# Altium schematic sheet powersupply_grid8_0.SchDoc: powersupply_grid8.sch
size 409 x 282 mm; Date: 12/19/2018 10:57:11 PM; SheetNumber: Sheet:
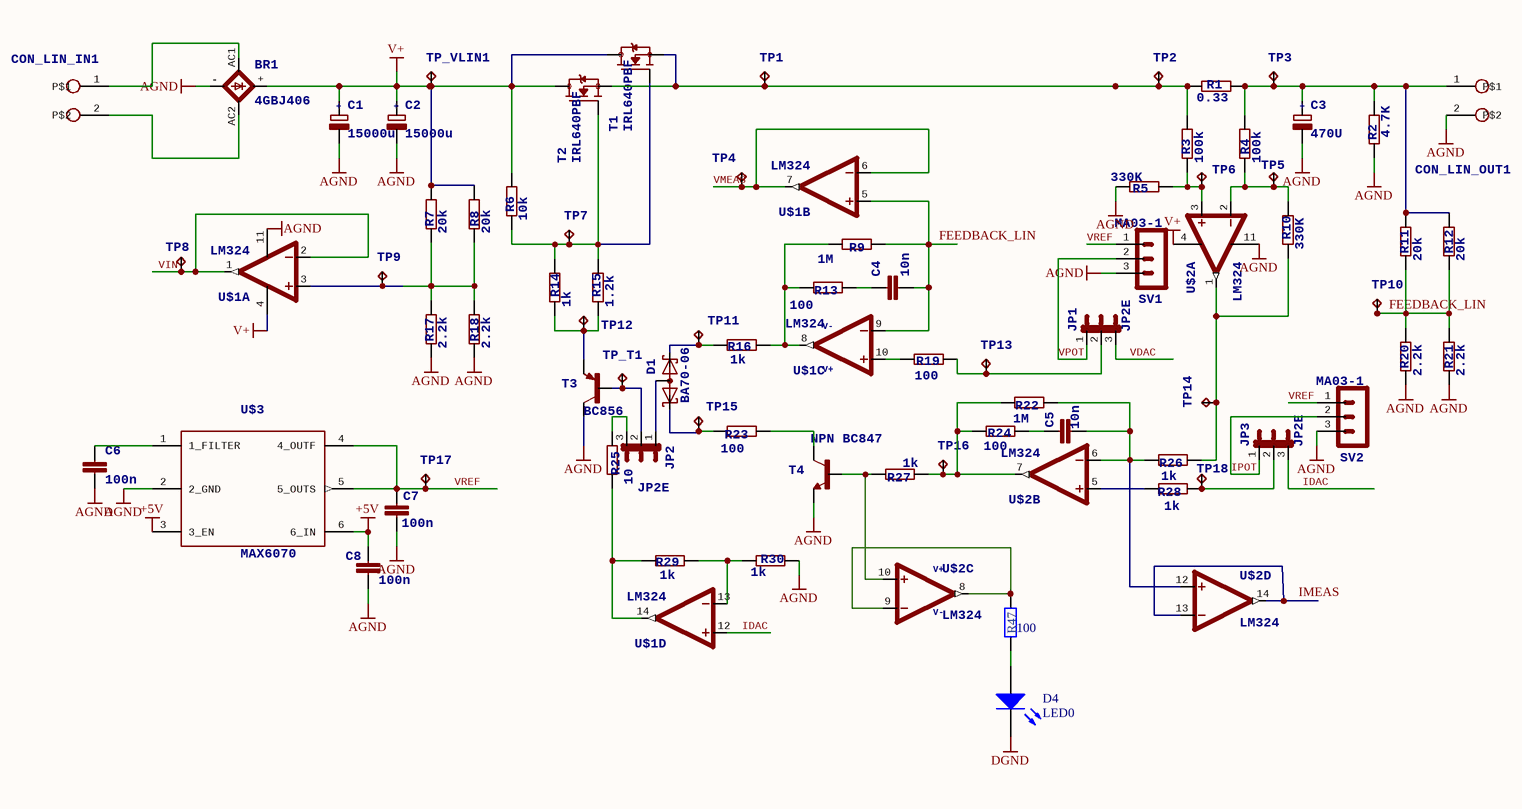
[diagram p0: powersupply_grid8_0.SchDoc]

## Parts
BR1  4GBJ406  [FB100]
C1  15000u  [EB30D]
C2  15000u  [EB30D]
C3  470U  [E5-13]
C4  10n  [C0805]
C5  10n  [C0805]
C6  100n  [C0402]
C7  100n  [C0402]
C8  100n  [C0402]
CON_LIN_IN1  POWERCON  [MKS1852-6-0-202]  (value not drawn)
CON_LIN_OUT1  POWERCON  [MKS1852-6-0-202]  (value not drawn)
D1  BA70-06  [SOT23]
D4  LED0  [LED-0]
JP1  JP2E  [JP2]
JP2  JP2E  [JP2]
JP3  JP2E  [JP2]
R1  0.33  [R2010]
R2  4.7K  [R2512]
R3  100k  [R0805]
R4  100k  [R0805]
R5  330K  [R0805]
R6  10k  [R0805]
R7  20k  [R0805]
R8  20k  [R0805]
R9  1M  [R0805]
R10  330K  [R0805]
R11  20k  [R0805]
R12  20k  [R0805]
R13  100  [R0805]
R14  1k  [R0805]
R15  1.2k  [R0805]
R16  1k  [R0805]
R17  2.2k  [R0805]
R18  2.2k  [R0805]
R19  100  [R0805]
R20  2.2k  [R0805]
R21  2.2k  [R0805]
R22  1M  [R0805]
R23  100  [R0805]
R24  100  [R0805]
R25  10  [R0805]
R26  1k  [R0805]
R27  1k  [R0805]
R28  1k  [R0805]
R29  1k  [R0805]
R30  1k  [R0805]
R47  value 100  [6-0805_L]  (hidden comment: Res2)
SV1  MA03-1  [MA03-1]
SV2  MA03-1  [MA03-1]
T1  IRL640PBF  [TO-220AB]
T2  IRL640PBF  [TO-220AB]
T3  BC856  [SOT23-BEC]
T4  NPN BC847  [SOT23-BEC]
TP1  TPB2,54  [B2,54]  (value not drawn)
TP2  TPB2,54  [B2,54]  (value not drawn)
TP3  TPB2,54  [B2,54]  (value not drawn)
TP4  TPB2,54  [B2,54]  (value not drawn)
TP5  TPB2,54  [B2,54]  (value not drawn)
TP6  TPB2,54  [B2,54]  (value not drawn)
TP7  TPB2,54  [B2,54]  (value not drawn)
TP8  TPB2,54  [B2,54]  (value not drawn)
TP9  TPB2,54  [B2,54]  (value not drawn)
TP10  TPB2,54  [B2,54]  (value not drawn)
TP11  TPB2,54  [B2,54]  (value not drawn)
TP12  TPB2,54  [B2,54]  (value not drawn)
TP13  TPB2,54  [B2,54]  (value not drawn)
TP14  TPB2,54  [B2,54]  (value not drawn)
TP15  TPB2,54  [B2,54]  (value not drawn)
TP16  TPB2,54  [B2,54]  (value not drawn)
TP17  TPB2,54  [B2,54]  (value not drawn)
TP18  TPB2,54  [B2,54]  (value not drawn)
TP_T1  TPB2,54  [B2,54]  (value not drawn)
TP_VLIN1  TPB2,54  [B2,54]  (value not drawn)
U$1  LM324  [SO14]  (parts A,B,C,D of 4)
U$2  LM324  [SO14]  (parts A,B,C,D of 4)
U$3  MAX6070  [SOT23-6]

## Nets
+5V: C8.1 U$3.3(3_EN) U$3.6(6_IN)
AGND: BR1.- C1.- C2.- C3.- C6.2 C7.2 C8.2 CON_LIN_OUT1.2(P$2) R2.1 R5.2 R17.1 R18.1 R20.1 R21.1 R30.2 SV1.3 SV2.3 T3.C T4.E U$1.11(V-) U$2.11(V-) U$3.2(2_GND)
DGND: D4.2(K)
V+: BR1.+ C1.+ C2.+ R6.2 R7.2 R8.2 T1.P$2(D) T2.P$2(D) TP_VLIN1.TP U$1.4(V+) U$2.4(V+)
FEEDBACK_LIN: C4.2 R9.1 R11.1 R12.1 R20.2 R21.2 TP10.TP U$1.5(+IN) U$1.9(-IN)
IDAC: JP3.3 U$1.12(+IN)
IMEAS: U$2.13(-IN) U$2.14(OUT)
IPOT: JP3.1 SV2.2
VDAC: JP1.3
VIN: TP8.TP U$1.1(OUT) U$1.2(-IN)
VMEAS: TP4.TP U$1.6(-IN) U$1.7(OUT)
VPOT: JP1.1 SV1.2
VREF: C7.1 SV1.1 SV2.1 TP17.TP U$3.4(4_OUTF) U$3.5(5_OUTS)
NetBR1_AC1: BR1.AC1 CON_LIN_IN1.1(P$1)
NetBR1_AC2: BR1.AC2 CON_LIN_IN1.2(P$2)
NetC3_+: C3.+ CON_LIN_OUT1.1(P$1) R1.2 R2.2 R4.2 R11.2 R12.2 TP3.TP
NetC4_1: C4.1 R13.1
NetC5_1: C5.1 R24.1
NetC5_2: C5.2 R22.1 R26.2 U$2.6(-IN) U$2.12(+IN)
NetC6_1: C6.1 U$3.1(1_FILTER)
NetD1_1: D1.1(K1) R23.2 TP15.TP
NetD1_2: D1.2(K2) R16.2 TP11.TP
NetD1_3: D1.3(AA) JP2.1
NetD4_1: D4.1(A) R47.2
NetJP1_2: JP1.2 R19.1 TP13.TP
NetJP2_2: JP2.2 T3.B TP_T1.TP
NetJP2_3: JP2.3 R25.1
NetJP3_2: JP3.2 R28.1 TP18.TP
NetR1_1: R1.1 R3.2 T1.P$3(S) T2.P$3(S) TP1.TP TP2.TP
NetR3_1: R3.1 R5.1 TP6.TP U$2.3(+IN)
NetR4_1: R4.1 R10.2 TP5.TP U$2.2(-IN)
NetR6_1: R6.1 R14.2 R15.2 T1.P$1(G) T2.P$1(G) TP7.TP
NetR7_1: R7.1 R8.1 R17.2 R18.2 TP9.TP U$1.3(+IN)
NetR9_2: R9.2 R13.2 R16.1 U$1.8(OUT)
NetR10_1: R10.1 R26.1 TP14.TP U$2.1(OUT)
NetR14_1: R14.1 R15.1 T3.E TP12.TP
NetR19_2: R19.2 U$1.10(+IN)
NetR22_2: R22.2 R24.2 R27.1 TP16.TP U$2.7(OUT)
NetR23_1: R23.1 T4.C
NetR25_2: R25.2 R29.2 U$1.14(OUT)
NetR27_2: R27.2 T4.B U$2.10(+IN)
NetR28_2: R28.2 U$2.5(+IN)
NetR29_1: R29.1 R30.1 U$1.13(-IN)
NetR47_1: R47.1 U$2.8(OUT) U$2.9(-IN)

## Notes on the sheet
- 1
- 2
- 3
- 4
- 5
- 6
- 7
- 8
- A
- B
- C
- D
- E

## Library data of the parts
C1 C2 = CPOL-EUE10-30: <B>POLARIZED CAPACITOR</B>, European symbol; +: +
C3 = CPOL-EUE5-13: <B>POLARIZED CAPACITOR</B>, European symbol; +: +
C4 C5 = C-EUC0805: <B>CAPACITOR</B>, European symbol; SPICEPREFIX: C
C6-C8 = C-EUC0402: <B>CAPACITOR</B>, European symbol; SPICEPREFIX: C
D1 = BAS40-06
D4 = LED0: Typical INFRARED GaAs LED; Published: 8-Jun-2000; LatestRevisionDate: 08-Jul-2005; LatestRevisionNote: Mech Layer 1 removed.; PackageReference: LED-0; Publisher: Altium Limited; PackageDescription: LED; 2 Leads
JP1-JP3 = JP2E: <b>JUMPER</b>
R1 = R-EU_R2010: <B>RESISTOR</B>, European symbol
R2 = R-EU_R2512: <B>RESISTOR</B>, European symbol
R3-R30 = R-EU_R0805: <B>RESISTOR</B>, European symbol
R47 = Res2: Resistor; Published: 8-Jun-2000; LatestRevisionDate: 17-Jul-2002; LatestRevisionNote: Re-released for DXP Platform.; PackageReference: AXIAL-0.4; Publisher: Altium Limited; PackageDescription: Axial Device, Thru-Hole; 2 Leads; 0.4 in Pin Spacing
SV1 SV2 = MA03-1: <b>PIN HEADER</b>; OC_FARNELL: unknown; OC_NEWARK: unknown
T3 = *-PNP-SOT23-BEC: PNP Transistror
T4 = *-NPN-SOT23-BEC
TP1-TP18 TP_T1 TP_VLIN1 = TPB2,54: <b>Test pad</b>